# Altium schematic sheet Power Supplies.SchDoc: Yonder Parent TS-4900 Version
size Letter; DrawnBy: MTAN; Organization: Altium Limited; DocumentNumber: 1; Revision: D; SheetNumber: 1; SheetTotal: 5
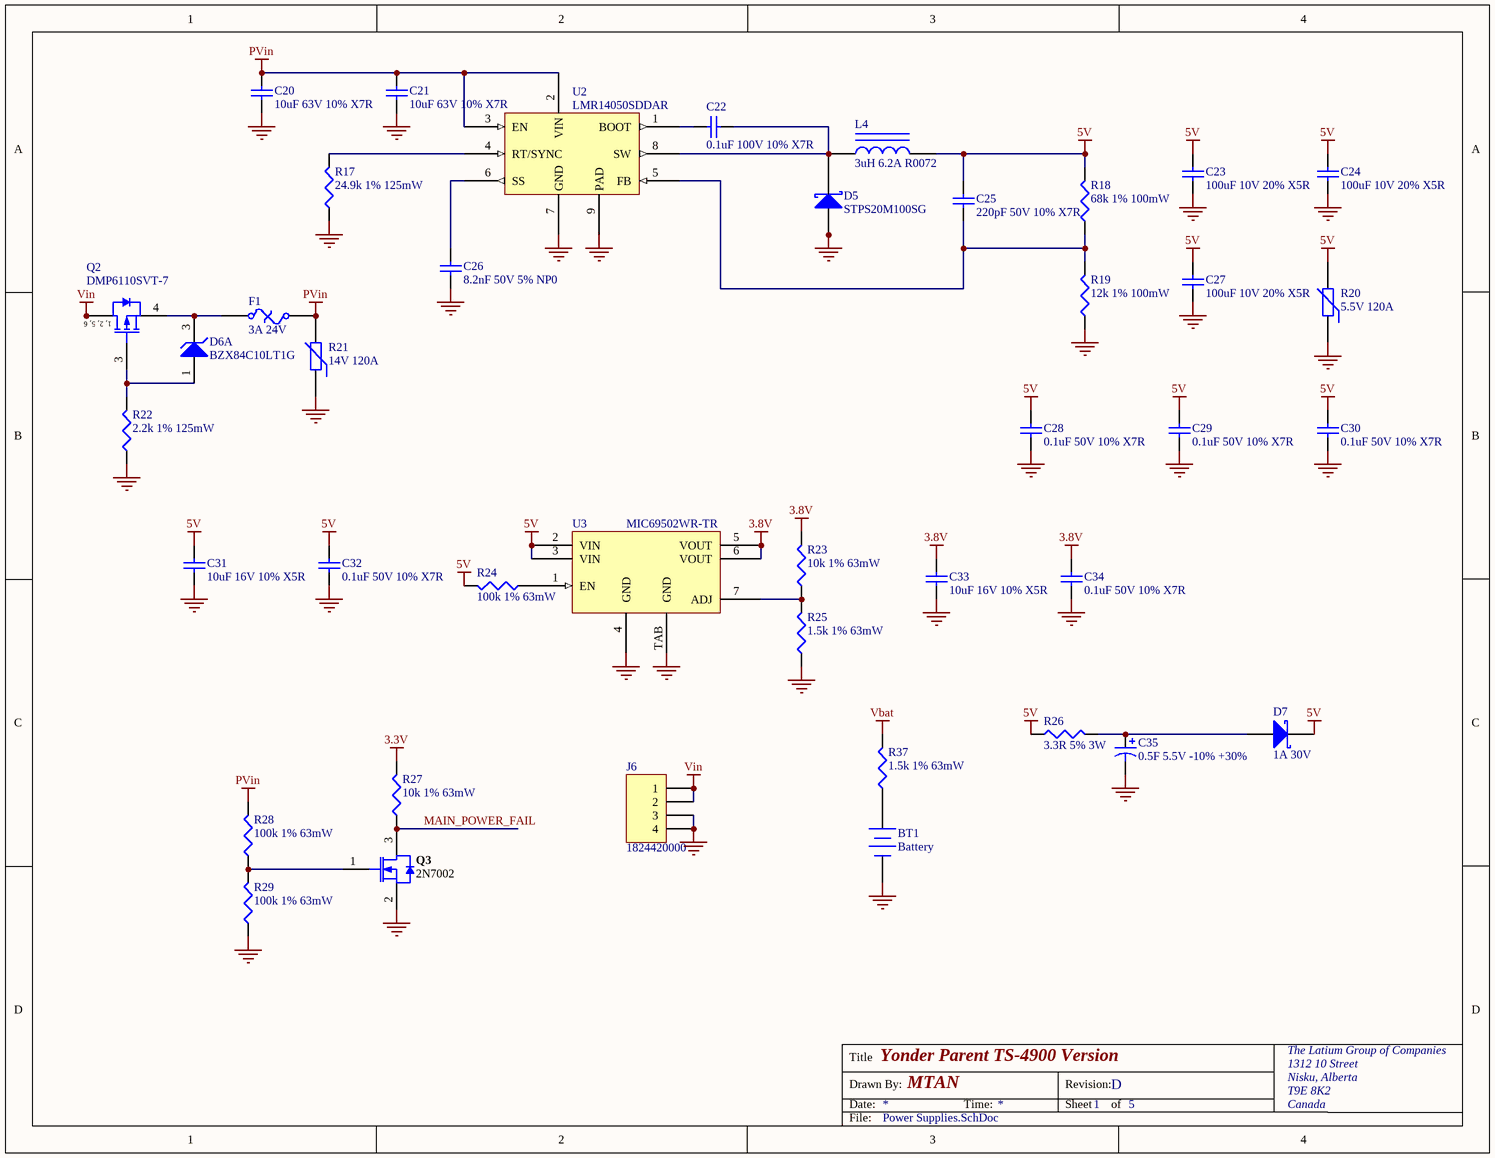
[diagram p0: Power Supplies.SchDoc]

## Parts
BT1  Battery  [MPD BS-7]
C20  10uF 63V 10% X7R  [C1210_L]
C21  10uF 63V 10% X7R  [C1210_L]
C22  0.1uF 100V 10% X7R  [C0805]
C23  100uF 10V 20% X5R  [C1210_L]
C24  100uF 10V 20% X5R  [C1210_L]
C25  220pF 50V 10% X7R  [1608[0603]]
C26  8.2nF 50V 5% NP0  [1608[0603]]
C27  100uF 10V 20% X5R  [C1210_L]
C28  0.1uF 50V 10% X7R  [CAPC1005L]
C29  0.1uF 50V 10% X7R  [CAPC1005L]
C30  0.1uF 50V 10% X7R  [CAPC1005L]
C31  10uF 16V 10% X5R  [C0805]
C32  0.1uF 50V 10% X7R  [CAPC1005L]
C33  10uF 16V 10% X5R  [C0805]
C34  0.1uF 50V 10% X7R  [CAPC1005L]
C35  0.5F 5.5V -10% +30%  [Illinois SuperCap]
D5  STPS20M100SG  [ONSC-D2PAK-3-418AJ_A_V]
D6  BZX84C10LT1G  [SOT23-3_L]  (part A of 2)
D7  1A 30V  [SOD323]
F1  3A 24V  [2920]
J6  1824420000  [1824420000]
L4  3uH 6.2A R0072  [SRU1048]
Q2  DMP6110SVT-7  [SOT23-6_L]
Q3  2N7002  [INF-PG-SOT23_L]
R17  24.9k 1% 125mW  [6-0805_L]
R18  68k 1% 100mW  [J1-0603]
R19  12k 1% 100mW  [J1-0603]
R20  5.5V 120A  [6-0805_L]
R21  14V 120A  [6-0805_L]
R22  2.2k 1% 125mW  [6-0805_L]
R23  10k 1% 63mW  [RESC1005L]
R24  100k 1% 63mW  [RESC1005L]
R25  1.5k 1% 63mW  [RESC1005L]
R26  3.3R 5% 3W  [RESC6432AL]
R27  10k 1% 63mW  [RESC1005L]
R28  100k 1% 63mW  [RESC1005L]
R29  100k 1% 63mW  [RESC1005L]
R37  1.5k 1% 63mW  [RESC1005L]
U2  LMR14050SDDAR  [MRA08A_L]
U3  MIC69502WR-TR  [SPak-7]

## Nets
3.3V: R27.2
3.8V: C33.1 C34.1 R23.2 U3.5(VOUT) U3.6(VOUT)
5V: C23.2 C24.2 C25.2 C27.2 C28.1 C29.1 C30.1 C31.1 C32.1 D7.1(K) L4.2 R18.2 R20.2 R24.2 R26.1 U3.2(VIN) U3.3(VIN)
GND: BT1.2(-) C20.1 C21.1 C23.1 C24.1 C26.1 C27.1 C28.2 C29.2 C30.2 C31.2 C32.2 C33.2 C34.2 C35.2 D5.1(A) D5.3(A) J6.3 J6.4 Q3.2(SOURCE) R17.1 R19.1 R20.1 R21.1 R22.1 R25.1 R29.1 U2.7(GND) U2.9(PAD) U3.4(GND) U3.TAB(GND)
PVin: C20.2 C21.2 F1.2 R21.2 R28.2 U2.2(VIN) U2.3(EN)
Vbat: R37.2
Vin: J6.1 J6.2 Q2.1(D) Q2.2(D) Q2.5(D) Q2.6(D)
MAIN_POWER_FAIL: Q3.3(DRAIN) R27.1
NetBT1_1: BT1.1(+) R37.1
NetC22_1: C22.1 D5.4(K) L4.1 U2.8(SW)
NetC22_2: C22.2 U2.1(BOOT)
NetC25_1: C25.1 R18.1 R19.2 U2.5(FB)
NetC26_2: C26.2 U2.6(SS)
NetC35_1: C35.1 D7.2(A) R26.2
NetD6_1: D6.1(A) Q2.3(G) R22.2
NetD6_3: D6.3(K) F1.1 Q2.4(S)
NetQ3_1: Q3.1(GATE) R28.1 R29.2
NetR17_2: R17.2 U2.4(RT/SYNC)
NetR23_1: R23.1 R25.2 U3.7(ADJ)
NetR24_1: R24.1 U3.1(EN)

## Notes on the sheet
- Title
- Drawn By:
- Date:
- Time:
- Revision:
- Sheet
- of
- The Latium Group of Companies
- 1312 10 Street
- Nisku, Alberta
- T9E 8K2
- Canada
- File:
- (in symbol NTGS3136PT1G) 1, 2, 5, 6

## Library data of the parts
BT1 = Battery: BATTERY HOLDER COIN 20MM PC PIN; Manufacturer: MPD (Memory Protection Devices); Manufacturer Part Number: BS-7; Value: CR2032 Coin Cell Holder; Supplier 1: Digi-Key; Supplier 1 Part Number: BS-7-ND
C20-C34 = Cap: Capacitor
  C20 C21: Value: 10uF 63V 10% X7R
  C22: Value: 0.1uF 100V 10% X7R
  C23 C24 C27: Value: 100uF 10V 20% X5R
  C25: Value: 220pF 50V 10% X7R
  C26: Value: 8.2nF 50V 5% NP0
  C28-C30 C32 C34: Value: 0.1uF 50V 10% X7R
  C31 C33: Value: 10uF 16V 10% X5R
C35 = Cap Pol1: CAP 500MF -10% +30% 5.5V TH; Manufacturer: Illinois Capacitor; Manufacturer Part Number: DGH504Q5R5; ComponentLink1Descrption: Data Sheet; Value: 0.5F 5.5V -10% +30%; Supplier 1: Digi-Key; Supplier 1 Part Number: 1572-1776-ND; ComponentLink1URL: S:\Hardware\Data Sheets\Passive\Capacitors\DGH series.pdf
D5 = BAS70: DIODE SCHOTTKY 100V 20A D2PAK; Manufacturer: STMicroelectronics; ComponentLink2Description: Datasheet; ComponentLink2URL: S:\Hardware\Data Sheets\Passive\Diodes\STPS20M100.pdf; Value: STPS20M100SG; Manufacturer Part Number: STPS20M100SG; Supplier 1: Digi-Key; Supplier 1 Part Number: 497-10993-1-ND
D6 = BZX84C10LT1G: DIODE ZENER 10V 225MW SOT23-3; Manufacturer: On Semiconductor; Supplier 1: Digi-Key; Supplier 1 Part Number: BZX84C10LT1GOSCT-ND; ComponentLink1Description: Data Sheet; ComponentLink1URL: S:\Hardware\Data Sheets\Passive\Diodes\BZX84C2V4LT1-D.pdf; Value: BZX84C10LT1G; Manufacturer Part Number: BZX84C10LT1G
D7 = D Schottky: Schottky Diode; Manufacturer: Toshiba Semiconductor and Storage; Manufacturer Part Number: CUS10S30,H3F; Value: 1A 30V; Supplier 1: Digi-Key; Supplier 1 Part Number: CUS10S30H3FCT-ND
F1 = Fuse Thermal: Thermal Fuse; Manufacturer Part Number: SMDC300F/24-2; Manufacturer: Littelfuse Inc; Value: 3A 24V; Supplier 1: Digi-Key; Supplier 1 Part Number: SMDC300F/24-2CT-ND
J6 = Header 4H: TERM BLK 2POS SIDE ENT 3.5MM PCB; Manufacturer: Weidmuller; Value: 1824420000; Manufacturer Part Number: 1824420000; Supplier 1: Digi-Key; Supplier 1 Part Number: 281-2020-ND
L4 = Inductor Iron: FIXED IND 3UH 6.2A 7.2 MOHM SMD; Manufacturer Part Number: SRU1048-3R0Y; Manufacturer: Bourns Inc; Value: 3uH 6.2A R0072; Supplier 1: Digi-Key; Supplier 1 Part Number: SRU1048-3R0YCT-ND; ComponentLink1Description: Data Sheet; ComponentLink1URL: S:\Hardware\Data Sheets\Passive\Inductors\SRU1048.pdf
Q2 = NTGS3136PT1G: MOSFET P-CH 60V TSOT26; Manufacturer: Diodes Incorporated; ComponentLink1Description: Data Sheet; ComponentLink1URL: S:\Hardware\Data Sheets\Passive\FETs\DMP6110SVT.pdf; Value: DMP6110SVT-7; Manufacturer Part Number: DMP6110SVT-7; Supplier 1: Digi-Key; Supplier 1 Part Number: DMP6110SVT-7DICT-ND
Q3 = 2N7002: MOSFET N-CH 60V 115MA SOT-23; Manufacturer: ON Semiconductor; PartNumber: 2N7002; ComponentLink1Description: Data Sheet; ComponentLink1URL: S:\Hardware\Data Sheets\Active\Transistors\FETs\NDS7002A-D.pdf; Manufacturer Part Number: 2N7002; Value: 2N7002; Supplier 1: Digi-Key; Supplier 1 Part Number: 2N7002NCT-ND
R17-R19 R22-R25 R27-R29 R37 = Res3: Resistor
  R17: Value: 24.9k 1% 125mW
  R18: Value: 68k 1% 100mW
  R19: Value: 12k 1% 100mW
  R22: Value: 2.2k 1% 125mW
  R23 R27: Value: 10k 1% 63mW
  R24 R28 R29: Value: 100k 1% 63mW
  R25 R37: Value: 1.5k 1% 63mW
R20 = Res Varistor: VARISTOR 8.2V 120A 0805; Manufacturer: Littelfuse Inc; Manufacturer Part Number: V5.5MLA0805H; Value: 5.5V 120A; Supplier 1: Digi-Key; Supplier 1 Part Number: F2215CT-ND
R21 = Res Varistor: VARISTOR 18.1V 120A 0805; Manufacturer: Littelfuse Inc; Manufacturer Part Number: V14MLA0805NH; Value: 14V 120A; Supplier 1: Digi-Key; Supplier 1 Part Number: F3734CT-ND
R26 = Res3: RES SMD 3.3 OHM 5% 3W 2512; Manufacturer: TE Connectivity Passive Product; Manufacturer Part Number: 35223R3JT; Value: 3.3R 5% 3W; Supplier 1: Digi-Key; Supplier 1 Part Number: A121247CT-ND
U2 = LMR14050: IC REG BUCK ADJUSTABLE 5A 8SOPWR; Manufacturer: Texas Instruments; Value: LMR14050SDDAR; Manufacturer Part Number: LMR14050SDDAR; Supplier 1: Digi-Key; Supplier 1 Part Number: 296-44322-1-ND; ComponentLink1Description: Data Sheet; ComponentLink1URL: S:\Hardware\Data Sheets\Active\Voltage Regulators\lmr14050.pdf
U3 = MIC69502: IC REG LINEAR POS ADJ 5A SPAK-7; Manufacturer: Microchip Technology; Value: MIC69502WR-TR; Manufacturer Part Number: MIC69502WR-TR; Supplier 1: Digi-Key; Supplier 1 Part Number: MIC69502WR-CT-ND; ComponentLink1Description: Data Sheet; ComponentLink1URL: S:\Hardware\Data Sheets\Active\Voltage Regulators\mic69502.pdf